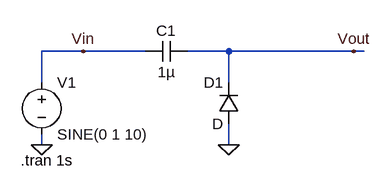
[diagram p0: schematic Diode-clamp.asc]
Diode-clamp.asc, the LTspice schematic file:
Version 4
SHEET 1 880 680
WIRE 0 128 -64 128
WIRE 96 128 0 128
WIRE 224 128 160 128
WIRE 416 128 224 128
WIRE 432 128 416 128
WIRE -64 176 -64 128
WIRE 224 176 224 128
WIRE -64 272 -64 256
WIRE 224 272 224 240
FLAG 224 272 0
FLAG 0 128 Vin
FLAG 416 128 Vout
FLAG -64 272 0
SYMBOL cap 160 112 R90
WINDOW 0 0 32 VBottom 2
WINDOW 3 32 32 VTop 2
SYMATTR InstName C1
SYMATTR Value 1µ
SYMBOL diode 240 240 R180
WINDOW 0 24 64 Left 2
WINDOW 3 24 0 Left 2
SYMATTR InstName D1
SYMBOL voltage -64 160 R0
WINDOW 123 0 0 Left 0
WINDOW 39 0 0 Left 0
SYMATTR InstName V1
SYMATTR Value SINE(0 1 10)
TEXT -96 296 Left 2 !.tran 1s

The netlist it stands for:
* Diode-clamp.asc
C1 Vout Vin 1µ
D1 0 Vout D
V1 Vin 0 SINE(0 1 10)
.model D D
.lib standard.dio
.tran 1s
.backanno
.end